# Altium schematic sheet smartee_main.SchDoc
size A
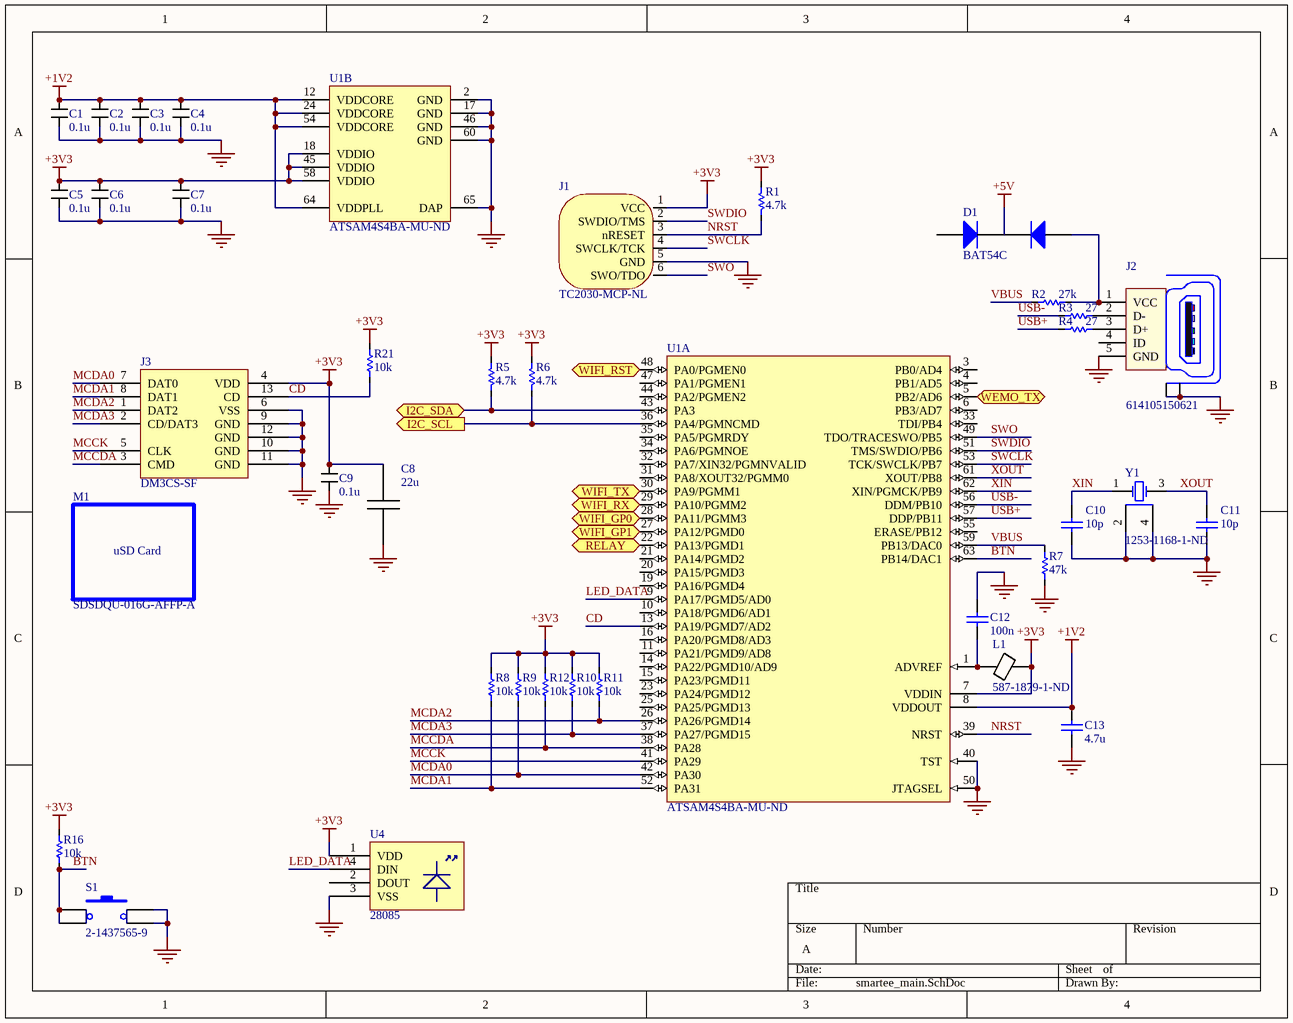
[diagram p0: smartee_main.SchDoc]

## Parts
C1  0.1u  [R0603]
C2  0.1u  [R0603]
C3  0.1u  [R0603]
C4  0.1u  [R0603]
C5  0.1u  [R0603]
C6  0.1u  [R0603]
C7  0.1u  [R0603]
C8  22u  [0805]
C9  0.1u  [R0603]
C10  value 10p  [0603]  (hidden comment: CAP)
C11  value 10p  [0603]  (hidden comment: CAP)
C12  value 100n  [0603]  (hidden comment: CAP)
C13  value 4.7u  [0603]  (hidden comment: CAP)
D1  BAT54C  [SOT23]
J1  TC2030-MCP-NL  [TC2030-MCP-NL]  (no BOM)
J2  614105150621  [614105150621]
J3  DM3CS-SF  [DM3CS-SF]
L1  Supplier Part Number 1: 587-1879-1-ND  [0603]  (hidden comment: Ferrite)
M1  SDSDQU-016G-AFFP-A  (mechanical)
R1  value 4.7k  [0603]  (hidden comment: RES)
R2  value 27k  [0603]  (hidden comment: RES)
R3  value 27  [0603]  (hidden comment: RES)
R4  value 27  [0603]  (hidden comment: RES)
R5  value 4.7k  [0603]  (hidden comment: RES)
R6  value 4.7k  [0603]  (hidden comment: RES)
R7  value 47k  [0603]  (hidden comment: RES)
R8  value 10k  [0603]  (hidden comment: RES)
R9  value 10k  [0603]  (hidden comment: RES)
R10  value 10k  [0603]  (hidden comment: RES)
R11  value 10k  [0603]  (hidden comment: RES)
R12  value 10k  [0603]  (hidden comment: RES)
R16  value 10k  [0603]  (hidden comment: RES)
R21  value 10k  [0603]  (hidden comment: RES)
S1  2-1437565-9  [2-1437565-9]
U1  Supplier Part Number 1: ATSAM4S4BA-MU-ND  [QFN64]  (hidden comment: SAM4S)  (parts A,B of 2)
U4  28085  [WS2812B]
Y1  Supplier Part Number 1: 1253-1168-1-ND  [XTAL_3.2x2.5mm]  (hidden comment: XTAL)

## Ports
I2C_SCL (out), I2C_SDA (bidir), RELAY (out), WEMO_TX (in), WIFI_GP0 (bidir), WIFI_GP1 (bidir), WIFI_RST (out), WIFI_RX (out), WIFI_TX (in)

## Nets
+1V2: C1.1 C2.1 C3.1 C4.1 C13.2 U1.8(VDDOUT) U1.12(VDDCORE) U1.24(VDDCORE) U1.54(VDDCORE) U1.64(VDDPLL)
+3V3: C5.1 C6.1 C7.1 C8.1 C9.1 J1.1(VCC) J3.4(VDD) L1.1 R1.1 R5.1 R6.1 R8.2 R9.2 R10.2 R11.2 R12.2 R16.2 R21.2 U1.7(VDDIN) U1.18(VDDIO) U1.45(VDDIO) U1.58(VDDIO) U4.1(VDD)
+5V: D1.3(K)
GND: C1.2 C2.2 C3.2 C4.2 C5.2 C6.2 C7.2 C8.2 C9.2 C10.1 C11.1 C12.2 C13.1 J1.5(GND) J2.5(GND) J2.Z1(Shield) J2.Z2(Shield) J3.6(VSS) J3.9(GND) J3.10(GND) J3.11(GND) J3.12(GND) R7.1 S1.3 S1.4 U1.2(GND) U1.17(GND) U1.40(TST) U1.46(GND) U1.50(JTAGSEL) U1.60(GND) U1.65(DAP) U4.3(VSS) Y1.2(GND) Y1.4(GND)
BTN: R16.1 S1.1 S1.2 U1.63(PB14/DAC1)
CD: J3.13(CD) R21.1 U1.13(PA19/PGMD7/AD2)
I2C_SCL: R6.2 U1.36(PA4/PGMNCMD) ; port I2C_SCL
I2C_SDA: R5.2 U1.43(PA3) ; port I2C_SDA
LED_DATA: U1.9(PA17/PGMD5/AD0) U4.4(DIN)
MCCDA: J3.3(CMD) R12.1 U1.38(PA28)
MCCK: J3.5(CLK) U1.41(PA29)
MCDA0: J3.7(DAT0) R9.1 U1.42(PA30)
MCDA1: J3.8(DAT1) R8.1 U1.52(PA31)
MCDA2: J3.1(DAT2) R11.1 U1.26(PA26/PGMD14)
MCDA3: J3.2(CD/DAT3) R10.1 U1.37(PA27/PGMD15)
NRST: J1.3(nRESET) R1.2 U1.39(NRST)
RELAY: U1.22(PA13/PGMD1) ; port RELAY
SWCLK: J1.4(SWCLK/TCK) U1.53(TCK/SWCLK/PB7)
SWDIO: J1.2(SWDIO/TMS) U1.51(TMS/SWDIO/PB6)
SWO: J1.6(SWO/TDO) U1.49(TDO/TRACESWO/PB5)
USB+: R4.1 U1.57(DDP/PB11)
USB-: R3.1 U1.56(DDM/PB10)
VBUS: R2.1 R7.2 U1.59(PB13/DAC0)
WEMO_TX: U1.5(PB2/AD6) ; port WEMO_TX
WIFI_GP0: U1.28(PA11/PGMM3) ; port WIFI_GP0
WIFI_GP1: U1.27(PA12/PGMD0) ; port WIFI_GP1
WIFI_RST: U1.48(PA0/PGMEN0) ; port WIFI_RST
WIFI_RX: U1.29(PA10/PGMM2) ; port WIFI_RX
WIFI_TX: U1.30(PA9/PGMM1) ; port WIFI_TX
XIN: C10.2 U1.62(XIN/PGMCK/PB9) Y1.1(OSC1)
XOUT: C11.2 U1.61(XOUT/PB8) Y1.3(OSC2)
NetC12_1: C12.1 L1.2 U1.1(ADVREF)
NetD1_1: D1.1(A1) J2.1(VCC) R2.2
NetJ2_2: J2.2(D-) R3.2
NetJ2_3: J2.3(D+) R4.2

Not connected (* = marked no-connect by the designer): D1 2(A2); J2 4(ID); U1 3(PB0/AD4) 4(PB1/AD5) 6(PB3/AD7) 10(PA18/PGMD6/AD1) 11(PA21/PGMD9/AD8) 14(PA22/PGMD10/AD9) 15(PA23/PGMD11) 16(PA20/PGMD8/AD3) 19(PA16/PGMD4) 20(PA15/PGMD3) 21(PA14/PGMD2) 23(PA24/PGMD12) 25(PA25/PGMD13) 31(PA8/XOUT32/PGMM0) 32(PA7/XIN32/PGMNVALID) 33(TDI/PB4) 34(PA6/PGMNOE) 35(PA5/PGMRDY) 44(PA2/PGMEN2) 47(PA1/PGMEN1) 55(ERASE/PB12); U4 2(DOUT)

## Library data of the parts
C1-C7 C9 = CC0603ZRY5V9BB104: CAP CER 0.1UF 50V Y5V 0603; Manufacturer: Yageo; Capacitance: 0.1µF; Tolerance: -20%, +80%; Temperature Coefficient: Y5V (F); Supplier 1: Digi-Key; Manufacturer Part Number: CC0603ZRY5V9BB104; RoHS: RoHS Compliant; Category: Capacitors; Stock 1: 130366; Pricing 1: 1=0.1, 10=0.017, 25=0.012, 100=0.0078, 250=0.0064, 500=0.00546, 1000=0.00426 (USD); Packaging: Cut Tape (CT); Voltage - Rated: 50V; Mounting Type: Surface Mount, MLCC; Operating Temperature: -30°C ~ 85°C; Applications: General Purpose; Ratings: -; Package / Case: 0603 (1608 Metric); Size / Dimension: 0.063" L x 0.031" W (1.60mm x 0.80mm); Height - Seated (Max): -; Thickness (Max): 0.035" (0.90mm); Lead Spacing: -; Features: -; Lead Style: -; ComponentLink1URL: http://www.yageo.com/documents/recent/UPY-GPHC_Y5V_6.3V-to-50V_5_revised.pdf; ComponentLink1Description: http://www.yageo.com/documents/recent/UPY-GPHC_Y5V_6.3V-to-50V_5_revised.pdf; Supplier Part Number 1: 311-1343-1-ND; Value: 0.1u
C8 = CL21A226MAQNNNE: CAP CER 22UF 25V 20% X5R 0805; Manufacturer: Samsung Electro-Mechanics America, Inc; Capacitance: 22µF; Supplier 1: Digi-Key; Manufacturer Part Number: CL21A226MAQNNNE; RoHS: RoHS Compliant; Category: Capacitors; Stock 1: 750834; Pricing 1: 1=0.47, 10=0.411, 25=0.2936, 50=0.2496, 100=0.2055, 250=0.1644, 500=0.14972, 1000=0.13503 (USD); Packaging: Cut Tape (CT); Voltage - Rated: 25V; Tolerance: ±20%; Temperature Coefficient: X5R; Mounting Type: Surface Mount, MLCC; Operating Temperature: -55°C ~ 85°C; Applications: General Purpose; Ratings: -; Package / Case: 0805 (2012 Metric); Size / Dimension: 0.079" L x 0.049" W (2.00mm x 1.25mm); Height - Seated (Max): -; Thickness (Max): 0.055" (1.40mm); Lead Spacing: -; Features: -; Lead Style: -; ComponentLink1URL: http://www.samsungsem.com/servlet/FileDownload?type=spec&file=CL21A226MAQNNNE.pdf; ComponentLink1Description: http://www.samsungsem.com/servlet/FileDownload?type=spec&file=CL21A226MAQNNNE.pdf; Supplier Part Number 1: 1276-2908-1-ND
C10-C13 = CAP: Capacitor; Published: 8-Jun-2000; LatestRevisionDate: 17-Jul-2002; LatestRevisionNote: Re-released for DXP Platform.; Publisher: Altium Limited
D1 = BAT54C: DIODE SCHOTTKY 30V 200MA SOT23; Manufacturer: Fairchild Semiconductor; Diode Configuration: 1 Pair Common Cathode; Voltage - Forward (Vf) (Max) @ If: 800mV @ 100mA; Speed: Small Signal =< 200mA (Io), Any Speed; Reverse Recovery Time (trr): 5ns; Current - Reverse Leakage @ Vr: 2µA @ 25V; Supplier 1: Digi-Key; Manufacturer Part Number: BAT54C; RoHS: RoHS Compliant; Category: Discrete Semiconductor Products; Stock 1: 113590; Pricing 1: 1=0.2, 10=0.183, 25=0.166, 100=0.1196, 250=0.07044, 500=0.05844, 1000=0.03986 (USD); Packaging: Cut Tape (CT); Diode Type: Schottky; Voltage - DC Reverse (Vr) (Max): 30V; Current - Average Rectified (Io) (per Diode): 200mA; Mounting Type: Surface Mount; Package / Case: TO-236-3, SC-59, SOT-23-3; Supplier Device Package: SOT-23-3 (TO-236); ComponentLink1URL: http://www.fairchildsemi.com/ds/BA/BAT54.pdf; ComponentLink1Description: http://www.fairchildsemi.com/ds/BA/BAT54.pdf; Supplier Part Number 1: BAT54CFSCT-ND
J1 = TC2030-MCP-NL: Tag Connect
J2 = 614105150621: CONN RCPT USB TYPE AB; Manufacturer: Wurth Electronics Inc; Connector Type: USB - micro AB; Number of Contacts: 5; Gender: Receptacle; Specifications: USB 2.0; Supplier 1: Digi-Key; Manufacturer Part Number: 614105150621; RoHS: RoHS Compliant; Category: Connectors, Interconnects; Stock 1: 2977; Pricing 1: 1=2.16, 10=1.94, 50=1.8, 100=1.66, 500=1.44 (USD); Packaging: Cut Tape (CT); Mounting Type: Through Hole, Vertical; Features: Board Guide, Shielded; Ingress Protection: -; ComponentLink1URL: http://katalog.we-online.de/em/datasheet/614105150621.pdf; ComponentLink1Description: http://katalog.we-online.de/em/datasheet/614105150621.pdf; Supplier Part Number 1: 732-5959-1-ND
J3 = DM3CS-SF: CONN MICRO SD R/A HING TYPE SMD; Manufacturer: Hirose Electric Co Ltd; Card Type: Secure Digital - microSD™; Number of Positions: 10 (8 + 2); Connector Type: Connector and Ejector; Insertion, Removal Method: Hinged Lid; Supplier 1: Digi-Key; Manufacturer Part Number: DM3CS-SF; RoHS: RoHS Compliant; Category: Connectors, Interconnects; Stock 1: 22015; Pricing 1: 1=1.66, 10=1.509, 25=1.4168, 50=1.3552, 100=1.2936, 250=1.1704, 500=1.078 (USD); Packaging: Cut Tape (CT); Ejector Side: -; Mounting Type: Surface Mount, Right Angle; Features: Switch; Height Above Board: 0.072" (1.83mm); Mounting Feature: Normal, Standard - Top; Contact Finish: Gold; Contact Finish Thickness: -; ComponentLink1URL: http://www.hirose.co.jp/cataloge_hp/e60900232.pdf; ComponentLink1Description: http://www.hirose.co.jp/cataloge_hp/e60900232.pdf; Supplier Part Number 1: HR1972CT-ND
L1 = Ferrite: Ferrite bead; Code_IEC: 1005; Value: 10mH; Published: 8-Jun-2000; LatestRevisionDate: 29-May-2009; LatestRevisionNote: IPC-7351 Footprint Added.; Publisher: Altium Limited; Code_JEITA: 0402; Supplier 1: Digi-Key
M1 = uSD Card: 16 GB uSD Card
R1-R12 R16 R21 = RES: Resistor; Published: 8-Jun-2000; LatestRevisionDate: 17-Jul-2002; LatestRevisionNote: Re-released for DXP Platform.; Publisher: Altium Limited
S1 = 2-1437565-9: SWITCH TACTILE SPST-NO 0.05A 12V; Manufacturer: TE Connectivity; Switch Function: Off-Mom; Contact Rating @ Voltage: 0.05A @ 24VDC; Actuator Type: Standard; Actuator Height off PCB, from Pins: 4.30mm; Actuator Orientation: Top Actuated; Outline: 6.00mm x 6.00mm; Illumination: Non-Illuminated; Operating Force: 260gf; Actuator Material: Polyamide (PA), Nylon; Switch Travel: 0.25mm; Mechanical Life: 100,000 Cycles; Supplier 1: Digi-Key; Manufacturer Part Number: 2-1437565-9; RoHS: RoHS Compliant; Category: Switches; Stock 1: 3222; Pricing 1: 1=0.25, 10=0.245, 25=0.2364, 50=0.228, 100=0.2154, 250=0.20276, 500=0.1943 (USD); Packaging: Cut Tape (CT); Circuit: SPST-NO; Mounting Type: Surface Mount; Termination Style: Gull Wing; Illumination Voltage (Nominal): -; Illumination Type, Color: -; Ingress Protection: -; Features: -; Operating Temperature: -35°C ~ 85°C; ComponentLink1URL: http://www.te.com/commerce/DocumentDelivery/DDEController?Action=srchrtrv&DocNm=2-1437565-7&DocType=Customer+Drawing&DocLang=English; ComponentLink1Description: http://www.te.com/commerce/DocumentDelivery/DDEController?Action=srchrtrv&DocNm=2-1437565-7&DocType=Customer+Drawing&DocLang=English; Supplier Part Number 1: 450-1792-1-ND
U1 = SAM4S: Atmel SAM4S microcontroller, 64 pin; Supplier 1: Digi-Key
U4 = 28085: WS2812 LED MODULE; Manufacturer: Parallax Inc; Wavelength: 623nm Red, 524nm Green, 466nm Blue; Configuration: Square; Voltage - Forward (Vf) (Typ): 2.1V Red, 3.2V Green, 3.2V Blue; Lens Type: Flat; Supplier 1: Digi-Key; Manufacturer Part Number: 28085; RoHS: RoHS Compliant; Category: Optoelectronics; Stock 1: 0; Pricing 1: 1=1.79 (USD); Packaging: -; Type: LED Engine; Color: Red, Green, Blue (RGB); CCT (K): -; Flux @ Current/Temperature - Test: -; Current - Test: -; Temperature - Test: -; Lumens/Watt @ Current - Test: -; Current - Max: -; CRI (Color Rendering Index): -; Viewing Angle: -; Features: -; Size / Dimension: 5.00mm L x 5.00mm W; Height: -; Light Emitting Surface (LES): -; ComponentLink1URL: http://www.parallax.com/sites/default/files/downloads/28085-WS2812B-RGB-LED-Datasheet.pdf; ComponentLink1Description: http://www.parallax.com/sites/default/files/downloads/28085-WS2812B-RGB-LED-Datasheet.pdf; Supplier Part Number 1: 28085-ND
Y1 = XTAL: Crystal Oscillator; Published: 8-Jun-2000; LatestRevisionDate: 17-Jul-2002; LatestRevisionNote: Re-released for DXP Platform.; Publisher: Altium Limited; Supplier 1: Digi-Key